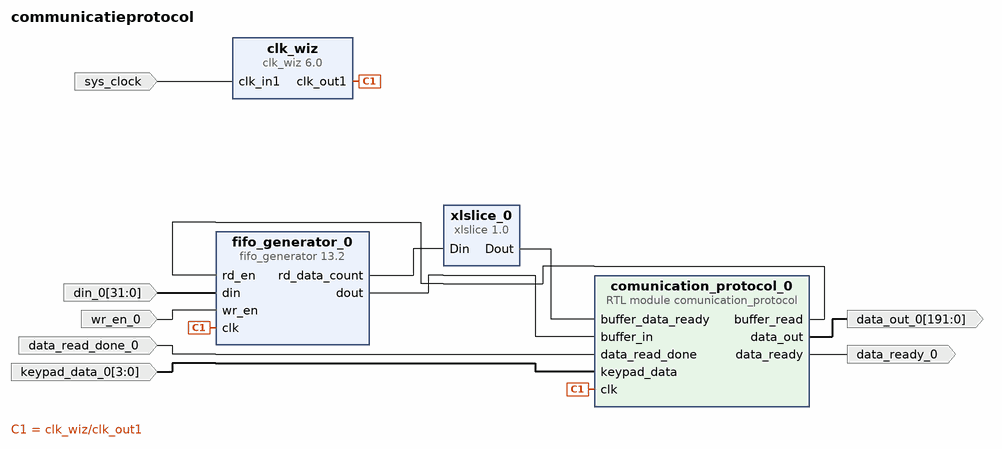
[diagram p0: block diagram of the top level]
# Vivado block design communicatieprotocol, xc7z020clg400-1, Vivado 2023.1
create_bd_design communicatieprotocol

create_bd_port -dir I -from 31 -to 0 din_0
create_bd_port -dir I wr_en_0
create_bd_port -dir I -type clk sys_clock
set_property -dict {CONFIG.FREQ_HZ 125000000 CONFIG.PHASE 0.0} [get_bd_ports sys_clock]
create_bd_port -dir I -from 3 -to 0 keypad_data_0
create_bd_port -dir I data_read_done_0
create_bd_port -dir O data_ready_0
create_bd_port -dir O -from 191 -to 0 data_out_0

create_bd_cell -type ip -vlnv xilinx.com:ip:fifo_generator:13.2 fifo_generator_0
set_property -dict [list \
  CONFIG.Almost_Full_Flag false \
  CONFIG.Fifo_Implementation Common_Clock_Block_RAM \
  CONFIG.INTERFACE_TYPE Native \
  CONFIG.Input_Data_Width 32 \
  CONFIG.Input_Depth 1024 \
  CONFIG.Output_Data_Width 128 \
  CONFIG.Programmable_Full_Type No_Programmable_Full_Threshold \
  CONFIG.Read_Data_Count true \
  CONFIG.Read_Data_Count_Width 9 \
  CONFIG.Reset_Pin false \
  CONFIG.Valid_Flag false \
  CONFIG.Write_Data_Count true \
  CONFIG.Write_Data_Count_Width 11 \
] [get_bd_cells fifo_generator_0]
create_bd_cell -type ip -vlnv xilinx.com:ip:clk_wiz:6.0 clk_wiz
set_property -dict [list \
  CONFIG.CLK_IN1_BOARD_INTERFACE sys_clock \
  CONFIG.USE_BOARD_FLOW true \
  CONFIG.USE_LOCKED false \
  CONFIG.USE_RESET true \
] [get_bd_cells clk_wiz]
create_bd_cell -type ip -vlnv xilinx.com:ip:xlslice:1.0 xlslice_0
set_property -dict {CONFIG.DIN_FROM 2 CONFIG.DIN_WIDTH 9} [get_bd_cells xlslice_0]
create_bd_cell -type module -reference comunication_protocol comunication_protocol_0

# ---- connections ----

connect_bd_net [get_bd_pins clk_wiz/clk_out1] [get_bd_pins fifo_generator_0/clk] [get_bd_pins comunication_protocol_0/clk]
connect_bd_net [get_bd_pins comunication_protocol_0/buffer_read] [get_bd_pins fifo_generator_0/rd_en]
connect_bd_net [get_bd_pins comunication_protocol_0/data_out] [get_bd_ports data_out_0]
connect_bd_net [get_bd_pins comunication_protocol_0/data_ready] [get_bd_ports data_ready_0]
connect_bd_net -net data_read_done_0_1 [get_bd_ports data_read_done_0] [get_bd_pins comunication_protocol_0/data_read_done]
connect_bd_net -net din_0_1 [get_bd_ports din_0] [get_bd_pins fifo_generator_0/din]
connect_bd_net [get_bd_pins fifo_generator_0/dout] [get_bd_pins comunication_protocol_0/buffer_in]
connect_bd_net [get_bd_pins fifo_generator_0/rd_data_count] [get_bd_pins xlslice_0/Din]
connect_bd_net -net keypad_data_0_1 [get_bd_ports keypad_data_0] [get_bd_pins comunication_protocol_0/keypad_data]
connect_bd_net [get_bd_ports sys_clock] [get_bd_pins clk_wiz/clk_in1]
connect_bd_net -net wr_en_0_1 [get_bd_ports wr_en_0] [get_bd_pins fifo_generator_0/wr_en]
connect_bd_net [get_bd_pins xlslice_0/Dout] [get_bd_pins comunication_protocol_0/buffer_data_ready]

validate_bd_design
save_bd_design
